# Altium schematic sheet Pulsed_IR_LED.SchDoc
size A3; SheetNumber: 1; SheetTotal: 1
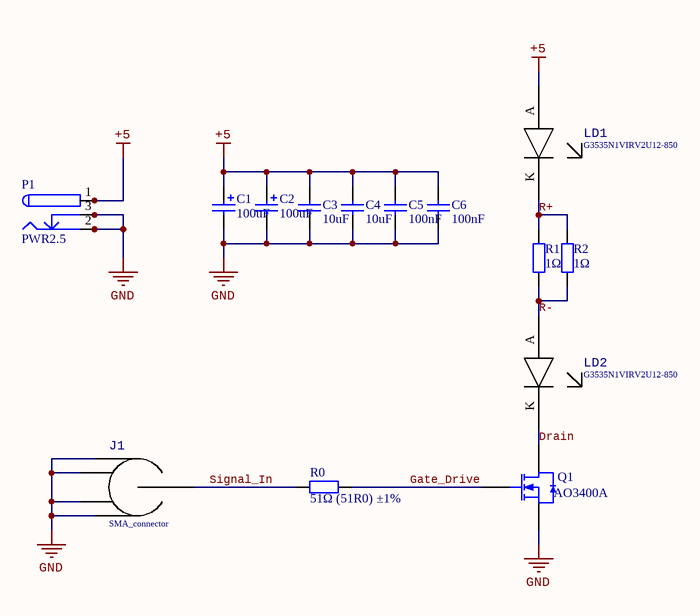
[diagram p0: Pulsed_IR_LED.SchDoc]

## Parts
C1  100uF  [CASE-B_3528]
C2  100uF  [CASE-B_3528]
C3  10uF  [0805_C]
C4  10uF  [0805_C]
C5  100nF  [0603_C]
C6  100nF  [0603_C]
J1  SMA_connector  [SMA_header]
LD1  G3535N1VIRV2U12-850  [3535VIR]
LD2  G3535N1VIRV2U12-850  [3535VIR]
P1  PWR2.5  [KLD-0202]
Q1  AO3400A  [SOT-23-3L]
R0  51Ω (51R0) ±1%  [0402_R]
R1  1Ω  [1206_R]
R2  1Ω  [1206_R]

## Nets
+5: C1.1 C2.1 C3.1 C4.1 C5.1 C6.1 LD1.A(Anode) P1.1 P1.1A P1.1B
GND: C1.2 C2.2 C3.2 C4.2 C5.2 C6.2 J1.2(GND) J1.3(GND) J1.4(GND) J1.5(GND) P1.2 P1.2A P1.2B P1.3 P1.3A P1.3B Q1.2(S)
Drain: LD2.K(Cathode) Q1.3(D)
Gate_Drive: Q1.1(G) R0.2
R+: LD1.K(Cathode) R1.1 R2.1
R-: LD2.A(Anode) R1.2 R2.2
Signal_In: J1.1(CORE) R0.1

## Library data of the parts
C1 C2 = 3528 100uF (107) 10% 6.3V: 钽电容; ComponentLink1Description: 供应商链接; ComponentLink1URL: http://www.szlcsc.com/product/details_16815.html; Package: 3528; Supplier: LC; SuppliersPartNumber: C16133
C3 C4 = 0805 10uF (106) 10% 25V: 贴片电容; ComponentLink1Description: 供应商链接; ComponentLink1URL: http://www.szlcsc.com/product/details_16532.html; Package: 0805; Supplier: LC; SuppliersPartNumber: C15850
C5 C6 = 0603 100nF (104) 10% 50V: 贴片电容; ComponentLink1Description: 供应商链接; ComponentLink1URL: http://www.szlcsc.com/product/details_15331.html; Package: 0603; Supplier: LC; SuppliersPartNumber: C14663
P1 = PWR2.5: Low Voltage Power Supply Connector; Published: 17-Dec-2003; DatasheetDocument: 09-May-2002; Publisher: Altium Limited; ComponentLink1Description: Manufacturer Link; ComponentLink1URL: http://domino.kycon.com/internet/Products.html
Q1 = AO3400A N道沟 X0YV1T SOT-23: MOS(场效应管); ComponentLink1Description: 供应商链接; ComponentLink1URL: http://www.szlcsc.com/product/details_21629.html; Package: SOT-23; Supplier: LC; SuppliersPartNumber: C20917
R0 = 0402 51Ω (51R0) 1%: 贴片电阻; ComponentLink1Description: 供应商链接; ComponentLink1URL: http://www.szlcsc.com/product/details_25868.html; Package: 0402; Supplier: LC; SuppliersPartNumber: C25125
R1 R2 = 1206 1Ω (1R00) 1%: 贴片电阻; ComponentLink1Description: 供应商链接; ComponentLink1URL: http://www.szlcsc.com/product/details_18616.html; Package: 1206; Supplier: LC; SuppliersPartNumber: C17928